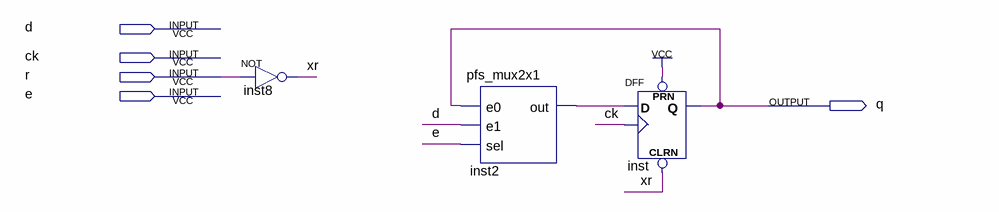
[diagram p0: schematic sheet]
// Quartus schematic pfs_ff_enable.bdf as structural Verilog: 3 symbols, 5 pins
module pfs_ff_enable (
  input  d,
  input  ck,
  input  r,
  input  e,
  output q
);

  wire inst2_out, xr;

  not inst8 (xr, r);
  pfs_mux2x1 inst2 (.e0(q), .e1(d), .sel(e), .out(inst2_out));
  DFF inst (.CLRN(xr), .CLK(ck), .D(inst2_out), .PRN(1'b1), .Q(q));
endmodule
